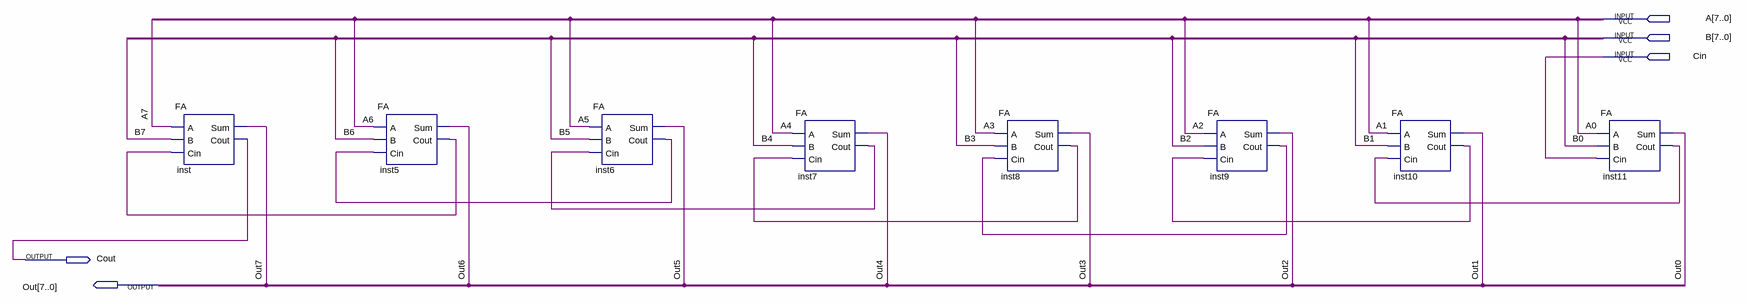
[diagram p0: schematic sheet]
// Quartus schematic eight_bit_FA.bdf as structural Verilog: 8 symbols, 5 pins
module eight_bit_FA (
  input  [7:0] A,
  input  [7:0] B,
  input  Cin,
  output Cout,
  output [7:0] Out
);

  wire inst5_cout, inst6_cout, inst7_cout, inst8_cout, inst9_cout, inst10_cout, inst11_cout;

  FA inst (.A(A[7]), .B(B[7]), .Cin(inst5_cout), .Sum(Out[7]), .Cout(Cout));
  FA inst5 (.A(A[6]), .B(B[6]), .Cin(inst6_cout), .Sum(Out[6]), .Cout(inst5_cout));
  FA inst6 (.A(A[5]), .B(B[5]), .Cin(inst7_cout), .Sum(Out[5]), .Cout(inst6_cout));
  FA inst7 (.A(A[4]), .B(B[4]), .Cin(inst8_cout), .Sum(Out[4]), .Cout(inst7_cout));
  FA inst8 (.A(A[3]), .B(B[3]), .Cin(inst9_cout), .Sum(Out[3]), .Cout(inst8_cout));
  FA inst9 (.A(A[2]), .B(B[2]), .Cin(inst10_cout), .Sum(Out[2]), .Cout(inst9_cout));
  FA inst10 (.A(A[1]), .B(B[1]), .Cin(inst11_cout), .Sum(Out[1]), .Cout(inst10_cout));
  FA inst11 (.A(A[0]), .B(B[0]), .Cin(Cin), .Sum(Out[0]), .Cout(inst11_cout));
endmodule
